# Altium project PCB_Project_1.PrjPcb
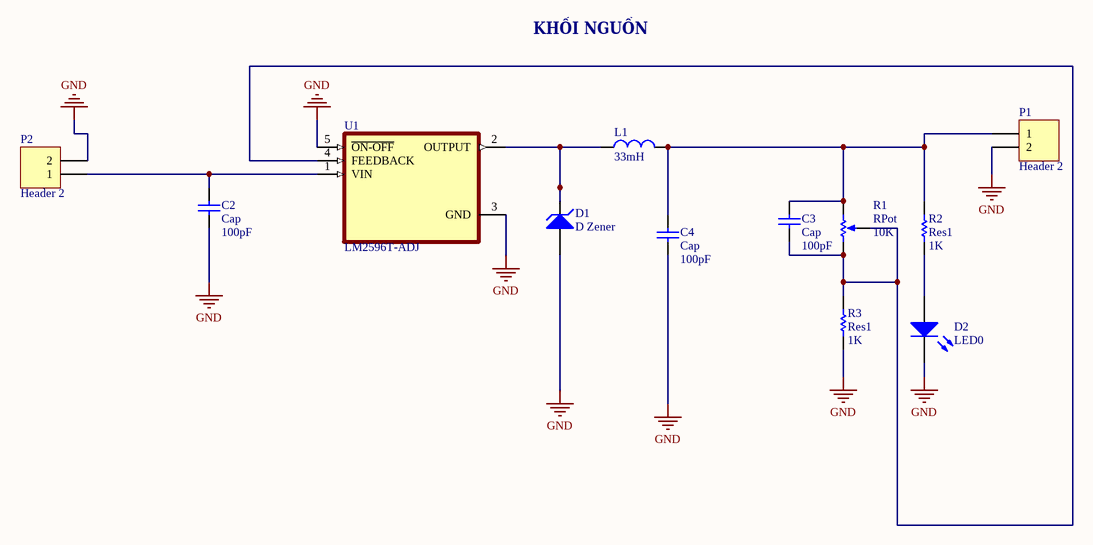
[diagram p0: Sheet5.SchDoc]
2 sheets, 35 parts. Net scope: flat (ports and power ports of the same name join across sheets).
Board files: PCB4.PcbDoc, PCB_MAIN.PcbDoc
Sheets:
  Sheet5.SchDoc
  main.SchDoc

## Sheet Sheet5.SchDoc
size A; SheetNumber: 1; SheetTotal: 2; SPICEModelCacheTCKSRXHH: <root> / <DocumentId>TCKSRXHH</DocumentId> / <CacheFrame Number="0"> / <Model Name="led0" Kind="MDL"> / <Text>*Typ INFRARED GaAs LED: Vf=1.2V Vr=5V If=40mA trr=3uS / *LED Pinout: 1=A, 2=K / .MODEL LED0 D (IS=93.5P RS=84M N=2.63 BV=5 IBV=10U / + CJO=2.97P VJ=.75 M=.333 TT=4.32U)</Text> / </Model> / <Model Name="zener" Kind="MDL"> / <Text>*ZENER / *Default Zener 10V @ 10mA / *Zener Diode Pinout: A,K / .MODEL ZENER D( BV=10 IBV=10E-3 )</Text> / </Model> / <Model Name="cap" Kind="MDL"> / <Text>*Default semiconductor capacitor / .MODEL CAP C()</Text> / </Model> / </CacheFrame> / </root>

### Parts
C2  Cap  value 100pF  [RAD-0.3]
C3  Cap  value 100pF  [RAD-0.3]
C4  Cap  value 100pF  [RAD-0.3]
D1  D Zener  [DIODE-0.7]
D2  LED0  [LED-0]
L1  33mH  [L/0.4]
P1  Header 2  [HDR1X2]
P2  Header 2  [HDR1X2]
R1  RPot  value 10K  [VR5]
R2  Res1  value 1K  [AXIAL-0.3]
R3  Res1  value 1K  [AXIAL-0.3]
U1  LM2596T-ADJ  [TO170P1016X470X2092-5]

### Nets
GND: C2.1 C4.1 D1.1(A) D2.2(K) P1.2 P2.2 R3.1 U1.3(GND) U1.5(~{ON-OFF})
NetC2_2: C2.2 P2.1 U1.1(VIN)
NetC3_1: C3.1 R1.1(TOP) R1.3(TAP) R3.2 U1.4(FEEDBACK)
NetC3_2: C3.2 C4.2 L1.2 P1.1 R1.2(BOT) R2.2
NetD1_2: D1.2(K) L1.1 U1.2(OUTPUT)
NetD2_1: D2.1(A) R2.1

### Notes on the sheet
- KHỐI NGUỒN

### Library data of the parts
C2-C4 = Cap: Capacitor; Published: 8-Jun-2000; LatestRevisionDate: 17-Jul-2002; LatestRevisionNote: Re-released for DXP Platform.; PackageReference: RAD-0.3; Publisher: Altium Limited; PackageDescription: Radial Cap, Thru-Hole; 2 Leads; 0.3 in Pin Spacing
D1 = D Zener: Zener Diode; Published: 8-Jun-2000; LatestRevisionDate: 17-Jul-2002; LatestRevisionNote: Re-released for DXP Platform.; PackageReference: DIODE-0.7; Publisher: Altium Limited; PackageDescription: Diode, Thru-Hole; 2 Leads; 0.7 in Pin Spacing
D2 = LED0: Typical INFRARED GaAs LED; Published: 8-Jun-2000; LatestRevisionDate: 08-Jul-2005; LatestRevisionNote: Mech Layer 1 removed.; PackageReference: LED-0; Publisher: Altium Limited; PackageDescription: LED; 2 Leads
L1 = L1: Inductor; Value: 150 mH
P1 P2 = Header 2: Header, 2-Pin; LatestRevisionDate: 17-Jul-2002; LatestRevisionNote: Re-released for DXP Platform.; Publisher: Altium Limited
R1 = RPot: Potentiometer; Sim Note: Enter the Resistance value and the set point into parameter fields.; Set Position: 0.5; Published: 8-Jun-2000; LatestRevisionDate: 17-Jul-2002; LatestRevisionNote: Re-released for DXP Platform.; PackageReference: VR5; Publisher: Altium Limited; PackageDescription: Variable Resistor, Thru-Hole; 3 Leads
R2 R3 = Res1: Resistor; Published: 8-Jun-2000; LatestRevisionDate: 17-Jul-2002; LatestRevisionNote: Re-released for DXP Platform.; PackageReference: AXIAL-0.3; Publisher: Altium Limited; PackageDescription: Axial Device, Thru-Hole; 2 Leads; 0.3 in Pin Spacing
U1 = LM2596T-ADJ: SIMPLE SWITCHER&reg; 4.5V to 40V, 3A Low Component Count Step-Down Regulator 5-TO-220 -40 to 125; MF: Texas Instruments; SnapEDA_Link: https://www.snapeda.com/parts/LM2596T-ADJ/Texas+Instruments/view-part/?ref=snap; Package: TO-220-5 Texas Instruments; Value: *; MP: LM2596T-ADJ; Check_prices: https://www.snapeda.com/parts/LM2596T-ADJ/Texas+Instruments/view-part/?ref=eda

## Sheet main.SchDoc
size A; SheetNumber: 2; SheetTotal: 2; SPICEModelCacheFNHRYBLI: <root> / <DocumentId>FNHRYBLI</DocumentId> / </root>
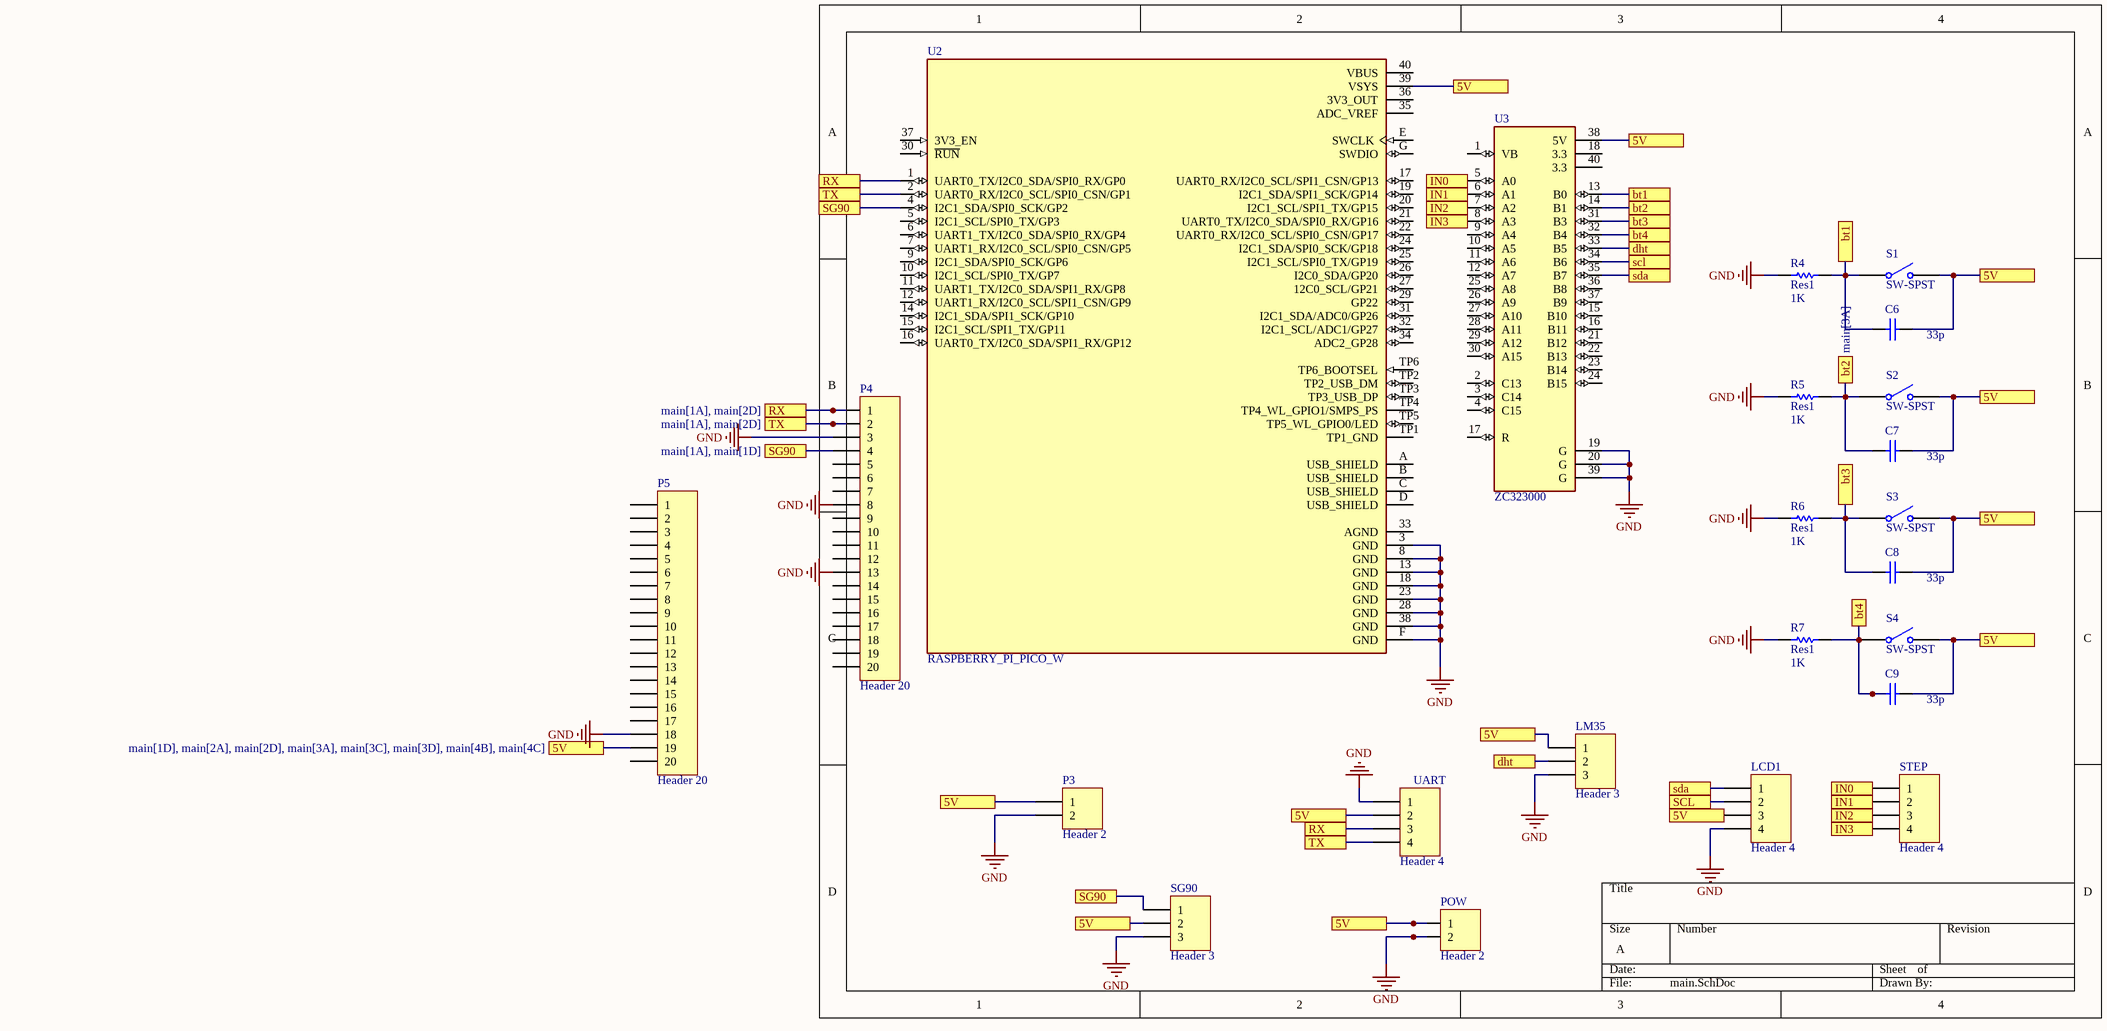
[diagram p1: main.SchDoc]

### Parts
C6  value 33p  [TU_GOM]  (hidden comment: Capacitor Ceramic)
C7  value 33p  [TU_GOM]  (hidden comment: Capacitor Ceramic)
C8  value 33p  [TU_GOM]  (hidden comment: Capacitor Ceramic)
C9  value 33p  [TU_GOM]  (hidden comment: Capacitor Ceramic)
LCD1  Header 4  [HDR1X4]
LM35  Header 3  [HDR1X3]
P3  Header 2  [HDR1X2]
P4  Header 20  [HDR1X20]
P5  Header 20  [HDR1X20]
POW  Header 2  [HDR1X2]
R4  Res1  value 1K  [AXIAL-0.3]
R5  Res1  value 1K  [AXIAL-0.3]
R6  Res1  value 1K  [AXIAL-0.3]
R7  Res1  value 1K  [AXIAL-0.3]
S1  SW-SPST  [SPST-2]
S2  SW-SPST  [SPST-2]
S3  SW-SPST  [SPST-2]
S4  SW-SPST  [SPST-2]
SG90  Header 3  [HDR1X3]
STEP  Header 4  [HDR1X4]
U2  RASPBERRY_PI_PICO_W  [MODULE_RASPBERRY_PI_PICO_W]
U3  ZC323000  [MODULE_ZC323000]
UART  Header 4  [HDR1X4]

### Ports
5V (see main[0C], main[1D], main[2A], main[2D], main[3A], main[3C], main[3D], main[4B], main[4C]), 5V (see main[0C], main[1D], main[2A], main[2D], main[3A], main[3C], main[4B], main[4C]), 5V (see main[0C], main[1D], main[2A], main[2D], main[3A], main[3D], main[4B], main[4C]), 5V (see main[0C], main[1D], main[2A], main[2D], main[3C], main[3D], main[4B], main[4C]), 5V (see main[0C], main[1D], main[2D], main[3A], main[3C], main[3D], main[4B], main[4C]), 5V (see main[1D], main[2A], main[2D], main[3A], main[3C], main[3D], main[4B], main[4C]), bt1 (see main[3A]), bt1 (see main[4B]), bt2 (see main[3A]), bt2 (see main[4B]), bt3 (see main[3A]), bt3 (see main[4B]), bt4 (see main[3A]), bt4 (see main[4C]), dht (see main[3A]), dht (see main[3C]), IN0 (see main[2A]), IN0 (see main[4D]), IN1 (see main[2A]), IN1 (see main[4D]), IN2 (see main[2A]), IN2 (see main[4D]), IN3 (see main[2A]), IN3 (see main[4D]), RX (see main[0B], main[1A]), RX (see main[0B], main[2D]), RX (see main[1A], main[2D]), SCL (see main[3B]), scl (see main[3D]), sda (see main[3B]), sda (see main[3D]), SG90 (see main[0B], main[1A]), SG90 (see main[0B], main[1D]), SG90 (see main[1A], main[1D]), TX (see main[0B], main[1A]), TX (see main[0B], main[2D]), TX (see main[1A], main[2D])

### Nets
GND: LCD1.4 LM35.3 P3.2 P4.3 P4.8 P4.13 P5.18 POW.2 R4.1 R5.1 R6.1 R7.1 SG90.3 U2.3(GND) U2.8(GND) U2.13(GND) U2.18(GND) U2.23(GND) U2.28(GND) U2.38(GND) U2.F(GND) U3.19(G) U3.20(G) U3.39(G) UART.1
NetC6_1: C6.1 R4.2 S1.1(COMMON) U3.13(B0) ; port bt1
NetC6_2: C6.2 C7.2 C8.2 C9.2 LCD1.3 LM35.1 P3.1 P5.19 POW.1 S1.2(NO) S2.2(NO) S3.2(NO) S4.2(NO) SG90.2 U2.39(VSYS) U3.38(5V) UART.2 ; port 5V
NetC7_1: C7.1 R5.2 S2.1(COMMON) U3.14(B1) ; port bt2
NetC8_1: C8.1 R6.2 S3.1(COMMON) U3.31(B3) ; port bt3
NetC9_1: C9.1 R7.2 S4.1(COMMON) U3.32(B4) ; port bt4
NetLCD1_1: LCD1.1 U3.35(B7) ; port sda
NetLCD1_2: LCD1.2 U3.34(B6) ; port scl, port SCL
NetLM35_2: LM35.2 U3.33(B5) ; port dht
NetP4_1: P4.1 U2.1(UART0_TX/I2C0_SDA/SPI0_RX/GP0) UART.3 ; port RX
NetP4_2: P4.2 U2.2(UART0_RX/I2C0_SCL/SPI0_CSN/GP1) UART.4 ; port TX
NetP4_4: P4.4 SG90.1 U2.4(I2C1_SDA/SPI0_SCK/GP2) ; port SG90
NetSTEP_1: STEP.1 U3.5(A0) ; port IN0
NetSTEP_2: STEP.2 U3.6(A1) ; port IN1
NetSTEP_3: STEP.3 U3.7(A2) ; port IN2
NetSTEP_4: STEP.4 U3.8(A3) ; port IN3

Not connected (* = marked no-connect by the designer): P4 5 6 7 9 10 11 12 14 15 16 17 18 19 20; P5 1 2 3 4 5 6 7 8 9 10 11 12 13 14 15 16 17 20; U2 5(I2C1_SCL/SPI0_TX/GP3) 6(UART1_TX/I2C0_SDA/SPI0_RX/GP4) 7(UART1_RX/I2C0_SCL/SPI0_CSN/GP5) 9(I2C1_SDA/SPI0_SCK/GP6) 10(I2C1_SCL/SPI0_TX/GP7) 11(UART1_TX/I2C0_SDA/SPI1_RX/GP8) 12(UART1_RX/I2C0_SCL/SPI1_CSN/GP9) 14(I2C1_SDA/SPI1_SCK/GP10) 15(I2C1_SCL/SPI1_TX/GP11) 16(UART0_TX/I2C0_SDA/SPI1_RX/GP12) 17(UART0_RX/I2C0_SCL/SPI1_CSN/GP13) 19(I2C1_SDA/SPI1_SCK/GP14) 20(I2C1_SCL/SPI1_TX/GP15) 21(UART0_TX/I2C0_SDA/SPI0_RX/GP16) 22(UART0_RX/I2C0_SCL/SPI0_CSN/GP17) 24(I2C1_SDA/SPI0_SCK/GP18) 25(I2C1_SCL/SPI0_TX/GP19) 26(I2C0_SDA/GP20) 27(12C0_SCL/GP21) 29(GP22) 30(~{RUN}) 31(I2C1_SDA/ADC0/GP26) 32(I2C1_SCL/ADC1/GP27) 33(AGND) 34(ADC2_GP28) 35(ADC_VREF) 36(3V3_OUT) 37(3V3_EN) 40(VBUS) A(USB_SHIELD) B(USB_SHIELD) C(USB_SHIELD) D(USB_SHIELD) E(SWCLK) G(SWDIO) TP1(TP1_GND) TP2(TP2_USB_DM) TP3(TP3_USB_DP) TP4(TP4_WL_GPIO1/SMPS_PS) TP5(TP5_WL_GPIO0/LED) TP6(TP6_BOOTSEL); U3 1(VB) 2(C13) 3(C14) 4(C15) 9(A4) 10(A5) 11(A6) 12(A7) 15(B10) 16(B11) 17(R) 18(3.3) 21(B12) 22(B13) 23(B14) 24(B15) 25(A8) 26(A9) 27(A10) 28(A11) 29(A12) 30(A15) 36(B8) 37(B9) 40(3.3)

### Library data of the parts
C6-C9 = TU_GOM_MH(0,047 µF--220pF)_MH: Capacitor; Published: 8-Jun-2000; LatestRevisionDate: 17-Jul-2002; LatestRevisionNote: Re-released for DXP Platform.; PackageReference: RAD-0.3; Publisher: Altium Limited
LCD1 STEP UART = Header 4: Header, 4-Pin; LatestRevisionDate: 17-Jul-2002; LatestRevisionNote: Re-released for DXP Platform.; Publisher: Altium Limited
LM35 SG90 = Header 3: Header, 3-Pin; LatestRevisionDate: 17-Jul-2002; LatestRevisionNote: Re-released for DXP Platform.; Publisher: Altium Limited
P3 POW = Header 2: Header, 2-Pin; LatestRevisionDate: 17-Jul-2002; LatestRevisionNote: Re-released for DXP Platform.; Publisher: Altium Limited
P4 P5 = Header 20: Header, 20-Pin; LatestRevisionDate: 17-Jul-2002; LatestRevisionNote: Re-released for DXP Platform.; Publisher: Altium Limited
R4-R7 = Res1: Resistor; Published: 8-Jun-2000; LatestRevisionDate: 17-Jul-2002; LatestRevisionNote: Re-released for DXP Platform.; PackageReference: AXIAL-0.3; Publisher: Altium Limited; PackageDescription: Axial Device, Thru-Hole; 2 Leads; 0.3 in Pin Spacing
S1-S4 = SW-SPST: Single-Pole, Single-Throw Switch; Published: 24-Mar-1999; LatestRevisionDate: 17-Jul-2002; LatestRevisionNote: Re-released for DXP Platform.; PackageReference: SPST-2; Publisher: Altium Limited; PackageDescription: Switch; 2 Leads
U2 = RASPBERRY_PI_PICO_W: Raspberry Pi Board, Arm Cortex-M0+; Silicon Manufacturer:Raspberry Pi; No. Of Bits:32Bit; Silicon Family Name:-; Core Architecture:Arm; Core Sub-Architecture:Cortex-M0+; Silicon Core Number:Rp2040; Product Range:Raspberry Pi Pico Rohs Compliant: Yes |Raspberry-Pi RASPBERRY PI PICO W; SnapEDA_Link: https://www.snapeda.com/parts/RASPBERRY%20PI%20PICO%20W/Raspberry+Pi/view-part/?ref=snap; Package: None; Value: *; MF: Raspberry Pi; MP: RASPBERRY PI PICO W; Check_prices: https://www.snapeda.com/parts/RASPBERRY%20PI%20PICO%20W/Raspberry+Pi/view-part/?ref=eda
U3 = ZC323000: STM32F103C8T6 ARM STM32 Minimum System Development Board Module For Arduino; Package: None; MP: ZC323000; Value: *; Availability: Unavailable; Price: None

## Nets that join several sheets
GND: Sheet5 (9 pins), main (25 pins)